# EasyEDA Pro project Armor_ProProject.epro, board PCB12
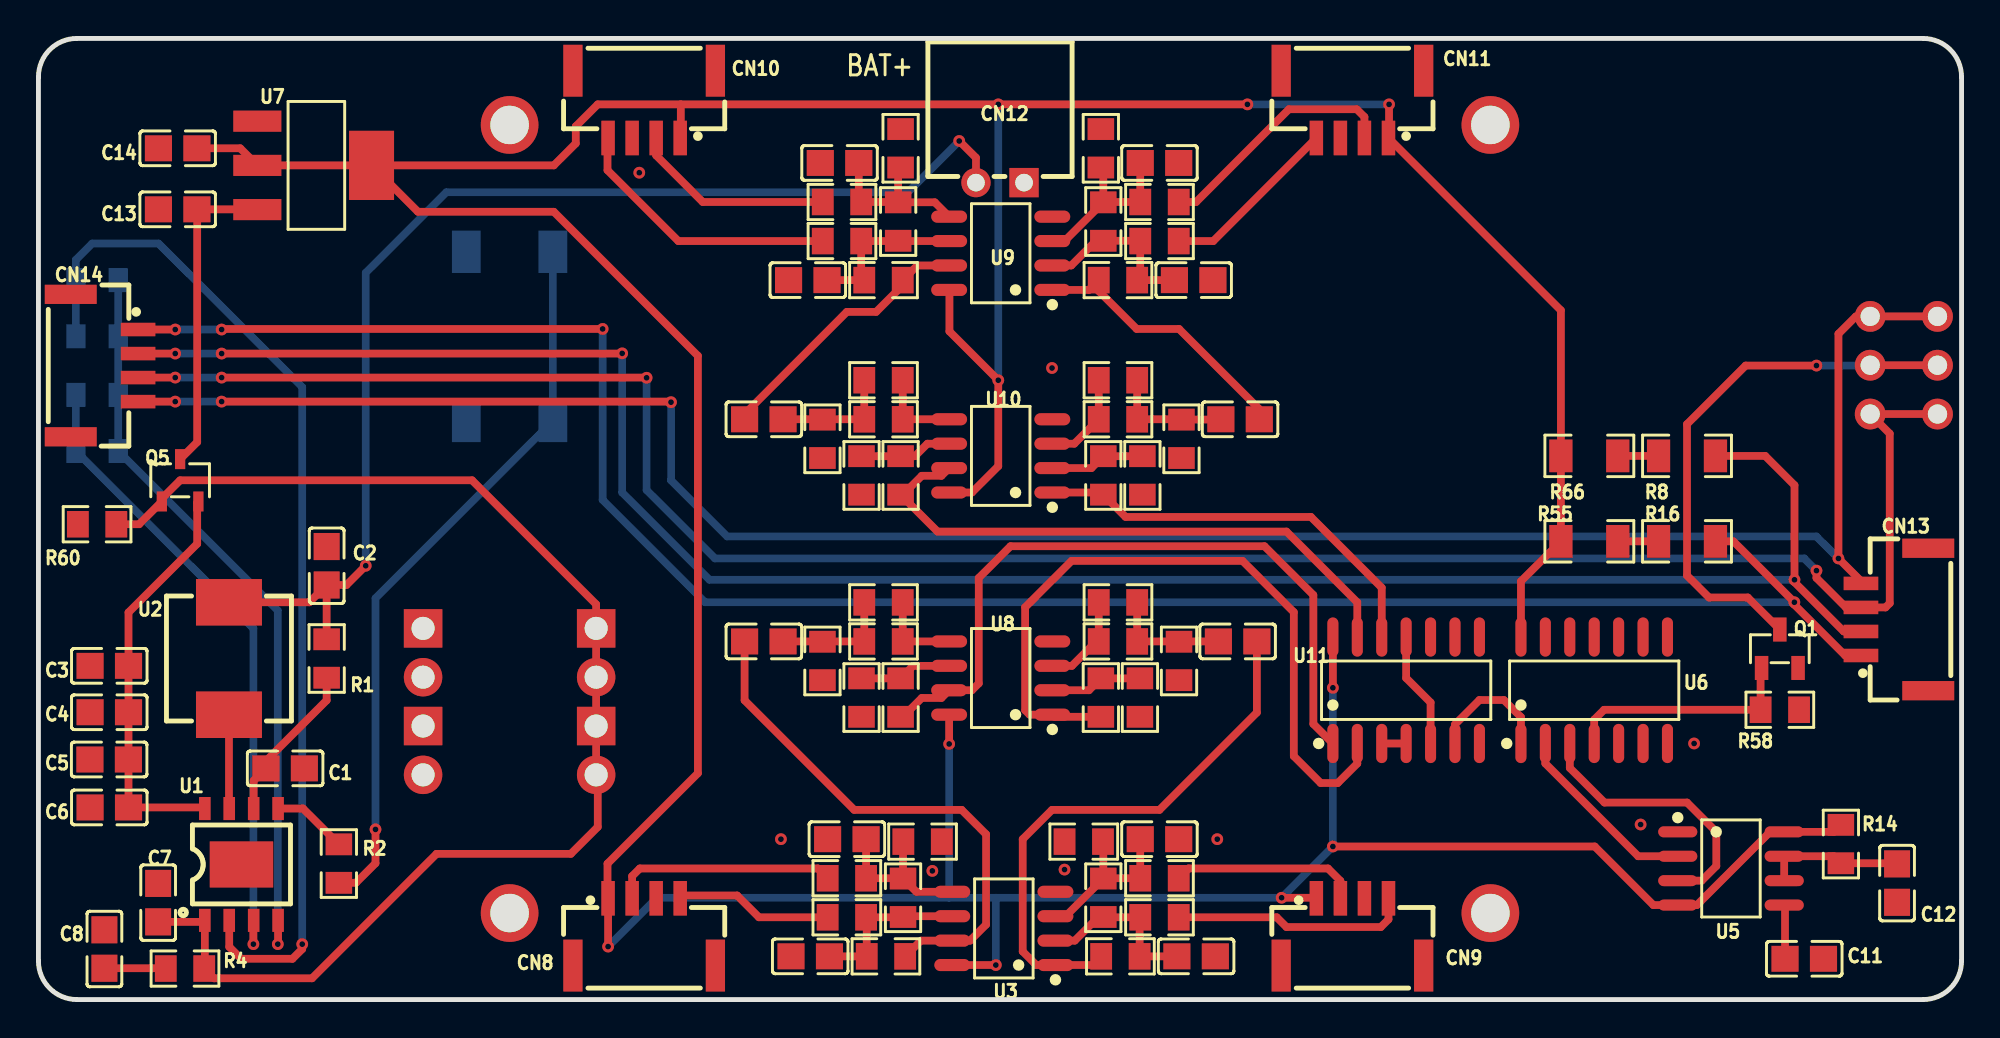
[diagram p12: board, top side]
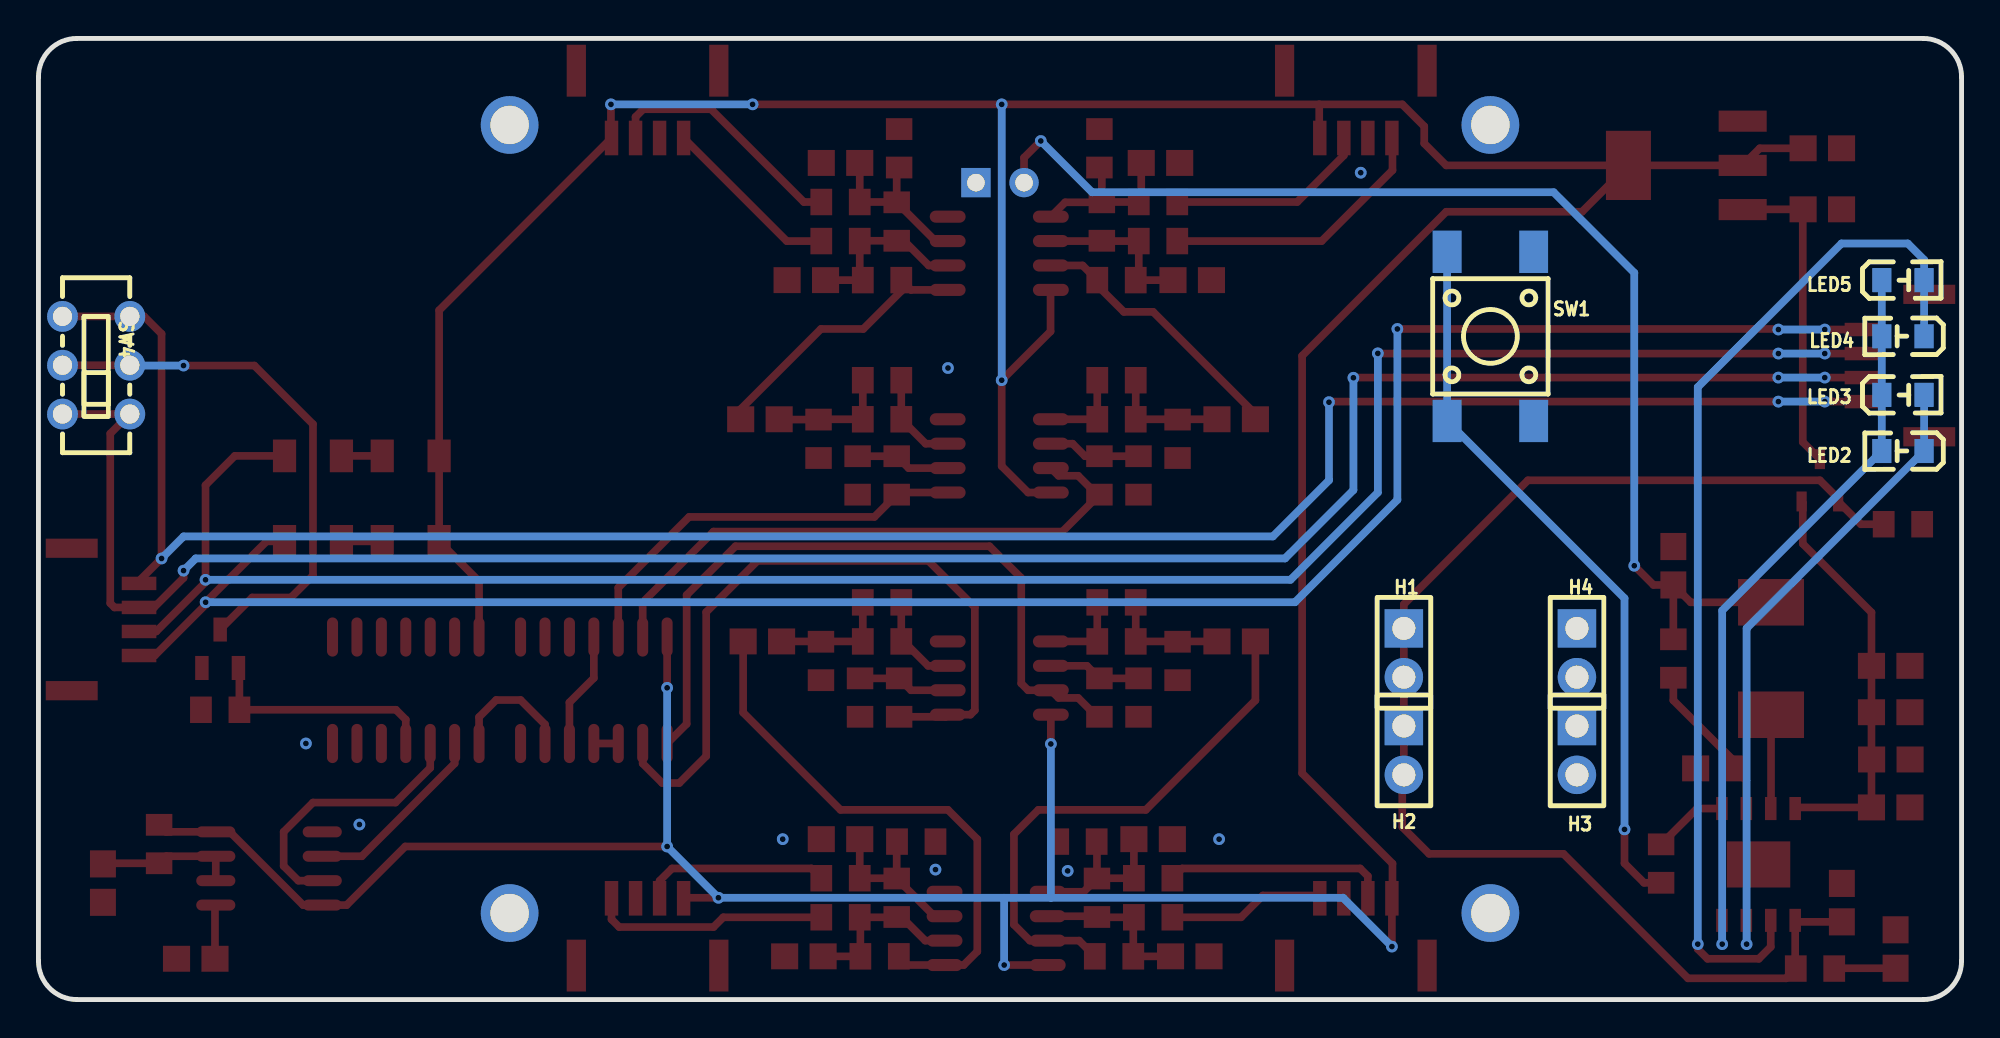
[diagram p13: board, bottom side, seen from below]

Outline 100 x 50 mm; copper layers: Top Layer, Bottom Layer. Coordinates in mm from the lower left corner of the outline.
Outline path: 0,48 0,2 arc(0.59,0.59) 2,0 98,0 arc(99.41,0.59) 100,2 100,48 arc(99.41,49.41) 98,50 2,50 arc(0.59,49.41) 0,48
Stack: Top Layer 0.035mm / Dielectric1 1.51mm FR4 er 4.5 / Bottom Layer 0.035mm

## Design rules (mm)
template: JLCPCB Capability(Two Layers Board)
spacing copperThickness1oz (default): track to track 0.102, other pairs 0.152 to 0.3
spacing copperThickness2oz: track to track 0.203, other pairs 0.152 to 0.3
track width copperThickness1oz (default): min 0.127, default 0.254, max 2.54
track width copperThickness2oz: min 0.203, default 0.254, max 2.54
differential pair differentialPair (default): width min 0.127, default 0.254, max 2.54; gap min 0.152, default 0.152
via viaSize (default): diameter min 0.5, default 0.61, max 10; hole min 0.3, default 0.305, max 6.3

## Placement (name value [footprint] x y rotation side)
C1  22uF  [C0805]  12.83 12.03 180 top
C2  22uF  [C0805]  14.99 22.57 270 top
C3  22uF  [C0805]  3.68 17.36 0 top
C4  22uF  [C0805]  3.68 14.95 0 top
C5  22uF  [C0805]  3.68 12.49 0 top
C6  22uF  [C0805]  3.68 10 0 top
C7  10uF  [C0805]  6.22 5.04 90 top
C8  10uF  [C0805]  3.43 2.63 90 top
C9  100nF  [C0805]  42.04 8.34 0 top
C10  100nF  [C0805]  40.13 2.25 180 top
C11  10nF  [C0805]  91.82 2.12 180 top
C12  10uF  [C0805]  96.65 6.06 90 top
C13  10uF  [C0805]  7.24 41.11 0 top
C14  10uF  [C0805]  7.24 44.28 180 top
C15  100nF  [C0805]  58.29 8.34 180 top
C16  100nF  [C0805]  60.2 2.25 0 top
C17  100nF  [C0805]  62.36 18.63 180 top
C18  100nF  [C0805]  37.72 18.63 0 top
C19  100nF  [C0805]  40 37.43 180 top
C20  100nF  [C0805]  41.66 43.52 0 top
C21  100nF  [C0805]  58.29 43.52 180 top
C22  100nF  [C0805]  60.07 37.43 0 top
C23  100nF  [C0805]  62.48 30.19 180 top
C24  100nF  [C0805]  37.72 30.19 0 top
CN8  应变片1  [CONN-SMD_4P-P1.27_GH125-S04DCA-00]  31.5 3.52 0 top
CN9  应变片2  [CONN-SMD_4P-P1.27_GH125-S04DCA-00]  68.33 3.52 0 top
CN10  应变片3  [CONN-SMD_4P-P1.27_GH125-S04DCA-00]  31.5 46.57 180 top
CN11  应变片4  [CONN-SMD_4P-P1.27_GH125-S04DCA-00]  68.33 46.57 180 top
CN12  电池  [CONN-TH_2P-P2.50_HDGC2501WR-2P]  50 42.5 180 top
CN13  LED2  [CONN-SMD_4P-P1.27_GH125-S04DCA-00]  96.52 19.77 90 top
CN14  LED1  [CONN-SMD_4P-P1.27_GH125-S04DCA-00]  3.43 32.98 270 top
H1  -  [HDR-TH_2P-P2.54-V-F]  29 18.04 270 bottom
H2  -  [HDR-TH_2P-P2.54-V-F]  29 12.96 270 bottom
H3  -  [HDR-TH_2P-P2.54-V-F]  20 12.96 270 bottom
H4  -  [HDR-TH_2P-P2.54-V-F]  20 18.04 270 bottom
LED2  D4  [LED0805-RD]  3.05 28.54 0 bottom
LED3  D3  [LED0805-RD]  3.05 31.46 180 bottom
LED4  D2  [LED0805-RD]  3.05 34.51 0 bottom
LED5  D1  [LED0805-RD]  3.05 37.43 180 bottom
NOREF  -  [Pad_e256]  24.5 45.5 0 top
NOREF#2  -  [Pad_e259]  75.5 45.5 0 top
NOREF#3  -  [Pad_e257]  24.5 4.5 0 top
NOREF#4  -  [Pad_e258]  75.5 4.5 0 top
Q1  NMOS  [SOT-23-3_L2.9-W1.3-P1.90-LS2.4-BR]  90.55 18.25 270 top
Q5  PMOS  [SOT-23-3_L3.0-W1.7-P0.95-LS2.9-BR]  7.37 27.01 270 top
R1  500mΩ  [R0805]  14.99 17.74 90 top
R2  10kΩ  [R0805]  15.62 7.07 90 top
R4  2Ω  [R0805]  7.62 1.61 180 top
R6  100Ω  [R0805]  42.04 6.31 180 top
R7  100Ω  [R0805]  42.04 4.28 0 top
R8  2Ω  [R1206]  85.72 28.28 0 top
R13  10kΩ  [R0805]  44.96 5.3 270 top
R14  5.1kΩ  [R0805]  93.73 8.09 270 top
R16  150mΩ  [R1206]  85.72 23.84 0 top
R17  33kΩ  [R0805]  44.07 2.25 0 top
R18  33kΩ  [R0805]  45.97 8.22 0 top
R19  10kΩ  [R0805]  55.37 5.3 270 top
R20  33kΩ  [R0805]  54.36 8.22 180 top
R21  33kΩ  [R0805]  56.26 2.25 180 top
R22  100Ω  [R0805]  58.29 4.28 180 top
R23  100Ω  [R0805]  58.29 6.31 180 top
R24  1kΩ  [R0805]  59.31 17.61 270 top
R25  1kΩ  [R0805]  40.77 17.61 270 top
R26  100Ω  [R0805]  56.13 18.63 180 top
R27  33kΩ  [R0805]  56.13 20.66 180 top
R28  100Ω  [R0805]  43.94 18.63 0 top
R29  33kΩ  [R0805]  43.94 20.66 0 top
R30  100Ω  [R0805]  57.28 15.71 90 top
R31  100Ω  [R0805]  42.8 15.71 90 top
R32  33kΩ  [R0805]  55.25 15.71 270 top
R33  33kΩ  [R0805]  44.83 15.71 270 top
R34  100Ω  [R0805]  41.78 41.49 180 top
R35  100Ω  [R0805]  41.78 39.46 0 top
R36  10kΩ  [R0805]  44.7 40.47 270 top
R37  33kΩ  [R0805]  44.83 44.28 90 top
R38  33kΩ  [R0805]  43.94 37.43 0 top
R39  10kΩ  [R0805]  55.37 40.47 270 top
R40  33kΩ  [R0805]  55.25 44.28 90 top
R41  33kΩ  [R0805]  56.13 37.43 180 top
R42  100Ω  [R0805]  58.29 39.46 180 top
R43  100Ω  [R0805]  58.29 41.49 180 top
R44  1kΩ  [R0805]  59.44 29.17 270 top
R45  1kΩ  [R0805]  40.77 29.17 270 top
R46  100Ω  [R0805]  56.13 30.19 180 top
R47  33kΩ  [R0805]  56.13 32.22 180 top
R48  100Ω  [R0805]  43.94 30.19 0 top
R49  33kΩ  [R0805]  43.94 32.22 0 top
R50  100Ω  [R0805]  57.4 27.27 90 top
R51  100Ω  [R0805]  42.8 27.27 90 top
R52  33kΩ  [R0805]  55.37 27.27 270 top
R53  33kΩ  [R0805]  44.83 27.27 270 top
R55  1.5Ω  [R1206]  80.65 23.84 0 top
R58  10kΩ  [R0805]  90.55 15.08 180 top
R60  10kΩ  [R0805]  3.05 24.73 180 top
R66  1Ω  [R1206]  80.65 28.28 0 top
SW1  KH-6X6X4.3H-STM  [SW-SMD_4P-L6.0-W6.0-P4.50-LS9.0]  24.5 34.5 270 bottom
SW4  R/B SW  [SW-TH_MSS22D18GX]  97 33 270 bottom
U1  充电宝  [ESOP-8_L4.9-W3.9-P1.27-LS6.0-BL-EP]  10.56 7.03 0 top
U2  1uH  [IND-SMD_L6.5-W6.5_IHLP-2525]  9.91 17.74 90 top
U3  LM358  [SOP-8_L4.9-W3.9-P1.27-LS6.0-BL]  50.2 3.7 90 top
U5  小于Vcc/3触发 输出高电平  [SOP-8_L5.0-W4.0-P1.27-LS6.0-BL]  88.01 6.82 270 top
U6  非门  [SOIC-14_L8.7-W3.9-P1.27-LS6.0-BL]  80.9 16.09 0 top
U7  NCP1117ST33T3G  [SOT-223-3_L6.5-W3.4-P2.30-LS7.0-BR]  14.35 43.4 180 top
U8  LM358  [SOP-8_L4.9-W3.9-P1.27-LS6.0-BL]  50.04 16.73 90 top
U9  LM358  [SOP-8_L4.9-W3.9-P1.27-LS6.0-BL]  50.04 38.82 90 top
U10  LM358  [SOP-8_L4.9-W3.9-P1.27-LS6.0-BL]  50.04 28.28 90 top
U11  或门  [SOIC-14_L8.7-W3.9-P1.27-LS6.0-BL]  71.12 16.09 0 top

## Footprints (pads in the part's own frame, mm; a bottom-side part is the same pattern mirrored in y, then rotated)
C0805
  rect 1.41x1.35 smd: 1(-1,0) 2(1,0)
CONN-SMD_4P-P1.27_GH125-S04DCA-00
  rect 0.7x1.8 smd: 1(-1.875,1.75) 2(-0.625,1.75) 3(0.625,1.75) 4(1.875,1.75)
  rect 1x2.7 smd: 5(3.705,-1.75) 6(-3.705,-1.75)
CONN-TH_2P-P2.50_HDGC2501WR-2P
  rect 1.524x1.524 hole 0.914: 1(-1.25,0)
  round 1.524 hole 0.914: 2(1.25,0)
ESOP-8_L4.9-W3.9-P1.27-LS6.0-BL-EP
  rect 0.6x1.2 smd: 1(-1.905,-2.909) 2(-0.635,-2.909) 3(0.635,-2.909) 4(1.905,-2.909) 5(1.905,2.909) 6(0.635,2.909) 7(-0.635,2.909) 8(-1.905,2.909)
  rect 3.3x2.4 smd: 9(0,0)
HDR-TH_2P-P2.54-V-F
  rect 2x2 hole 1.2: 1(-1.27,0)
  round 2 hole 1.2: 2(1.27,0)
IND-SMD_L6.5-W6.5_IHLP-2525
  rect 2.42x3.43 smd: 1(-2.925,0) 2(2.925,0)
LED0805-RD
  rect 1x1.25 smd: 1(-1.1,0) 2(1.1,0)
Pad_e256
  round 3 hole 2: 1(0,0)
Pad_e257
  round 3 hole 2: 1(0,0)
Pad_e258
  round 3 hole 2: 1(0,0)
Pad_e259
  round 3 hole 2: 1(0,0)
R0805
  rect 1.133x1.377 smd: 1(-1,0) 2(1,0)
R1206
  rect 1.208x1.701 smd: 1(-1.479,0) 2(1.479,0)
SOIC-14_L8.7-W3.9-P1.27-LS6.0-BL
  oval 0.574x2.038 smd: 1(-3.81,-2.769) 2(-2.54,-2.769) 3(-1.27,-2.769) 4(0,-2.769) 5(1.27,-2.769) 6(2.54,-2.769) 7(3.81,-2.769) 8(3.81,2.769) 9(2.54,2.769) 10(1.27,2.769) 11(0,2.769) 12(-1.27,2.769) 13(-2.54,2.769) 14(-3.81,2.769)
SOP-8_L4.9-W3.9-P1.27-LS6.0-BL
  oval 0.63x1.865 smd: 1(-1.905,-2.683) 2(-0.635,-2.683) 3(0.635,-2.683) 4(1.905,-2.683) 5(1.905,2.683) 6(0.635,2.683) 7(-0.635,2.683) 8(-1.905,2.683)
SOP-8_L5.0-W4.0-P1.27-LS6.0-BL
  oval 0.574x2.035 smd: 1(-1.905,-2.768) 2(-0.635,-2.768) 3(0.635,-2.768) 4(1.905,-2.768) 5(1.905,2.768) 6(0.635,2.768) 7(-0.635,2.768) 8(-1.905,2.768)
SOT-23-3_L2.9-W1.3-P1.90-LS2.4-BR
  rect 1.25x0.7 smd: 1(1,-0.95) 2(1,0.95) 3(-1,0)
SOT-23-3_L3.0-W1.7-P0.95-LS2.9-BR
  rect 1.038x0.532 smd: 1(1.101,-0.95) 2(1.101,0.95) 3(-1.101,0)
SOT-223-3_L6.5-W3.4-P2.30-LS7.0-BR
  rect 2.5x1.1 smd: 1(2.97,-2.3) 2(2.97,0) 3(2.97,2.3)
  rect 2.34x3.6 smd: 4(-2.97,0)
SW-SMD_4P-L6.0-W6.0-P4.50-LS9.0
  rect 2.2x1.5 smd: 1(-4.4,2.25) 2(-4.4,-2.25) 3(4.4,2.25) 4(4.4,-2.25)
SW-TH_MSS22D18GX
  round 1.6 hole 1: 1(-2.54,1.75) 2(0,1.75) 3(2.54,1.75) 4(-2.54,-1.75) 5(0,-1.75) 6(2.54,-1.75)

## Nets
As in the schematic.

Pads without a net: CN8 5 6; CN9 5 6; CN10 5 6; CN11 5 6; CN13 5 6; CN14 5 6; NOREF 1; NOREF#2 1; NOREF#3 1; NOREF#4 1; U6 5 6 8 9 10 11 12 13; U11 8 9 10

## Via types
v1: diameter 0.61, hole 0.305, Top Layer to Bottom Layer, 41 vias

## Routing (per net, layer and track width the routed paths; a pad name or vN(x,y) marks a point on that pad's centre or on a via; arc(x,y) is an arc through that point)
3V3: length 277
  Top Layer w0.4: U7.4 19.73,40.98 26.8,40.98 34.29,33.49 34.29,11.77 29.59,7.07 29.59,5.3 CN8.1 v1(29.62,2.76) ; U7.4 U7.2 10.49,44.28 C14.1 ; U7.4 26.8,43.4 27.94,44.54 27.94,45.43 29.08,46.57 33.4,46.57 ; CN9.1 66.42,5.3 v1(64.64,5.3) ; 33.4,46.57 33.4,44.85 CN10.1 ; 33.4,46.57 v1(49.91,46.57) v1(62.87,46.57) ; U8.8 v1(47.36,13.3) ; U3.8 v1(49.78,1.8) ; U10.8 48.54,26.38 49.91,27.75 v1(49.91,32.22) 47.37,34.76 47.37,36.9 U9.8 ; U6.14 77.09,21.76 R55.1 R66.1 79.17,35.86 CN11.1 70.23,44.85 v1(70.23,46.57) ; v1(67.31,7.96) 80.93,7.96 83.97,4.92 86.24,4.92 90.05,8.72 U5.8 93.36,8.72 R14.1 ; U11.14 v1(67.31,16.22)
  Bottom Layer w0.4: v1(62.87,46.57) v1(70.23,46.57) ; v1(49.91,46.57) v1(49.91,32.22) ; 47.35,5.3 32.16,5.3 v1(29.62,2.76) ; 47.35,5.3 49.79,5.3 ; 47.35,5.3 47.36,5.3 v1(47.36,13.3) ; v1(49.78,1.8) 49.78,5.29 49.79,5.3 ; v1(67.31,16.22) v1(67.31,7.96) v1(64.64,5.3) 49.79,5.3
GND:
  vias: v1(31.24,43.02) v1(38.61,8.34) v1(46.48,6.69) v1(52.71,32.86) v1(53.36,6.76) v1(61.3,8.34) v1(83.31,9.11) v1(86.09,13.32)
1GRAY: length 8.2
  Top Layer w0.4: CN8.4 33.52,5.41 36.33,5.41 37.47,4.28 R7.1
1WHITE: length 11.9
  Top Layer w0.4: R6.2 40.53,6.82 31.27,6.82 30.87,6.42 30.87,5.01
555OUT: length 14.4
  Top Layer w0.4: U5.3 86.49,6.19 87.25,6.95 87.25,8.72 85.72,10.25 81.43,10.25 79.63,12.05 U6.3
555OUTNO: length 12.3
  Top Layer w0.4: Q1.1 89.55,17.2 R58.2 81.41,15.08 80.9,14.56 U6.4
B-: length 113.5
  Top Layer w0.4: v1(92.46,22.31) 92.46,21.93 93.99,20.4 96.05,20.4 96.27,20.62 96.27,29.44 SW4.3 SW4.6 ; CN14.3 v1(7.11,32.36) ; v1(9.53,32.36) 31.61,32.36 v1(31.62,32.35)
  Bottom Layer w0.4: v1(92.46,22.31) 91.82,22.95 35.18,22.95 31.62,26.5 v1(31.62,32.35) ; v1(7.11,32.36) v1(9.53,32.36)
BAT+: length 62.2
  Top Layer w0.4: v1(17.02,22.57) 16.02,21.57 C2.2 ; CN12.2 48.75,43.8 v1(47.88,44.67) ; C2.2 14.08,20.67 U2.2 ; C2.2 R1.2
  Bottom Layer w0.4: v1(47.88,44.67) 45.21,42 21.21,42 17.02,37.81 v1(17.02,22.57)
NMOS-D: length 28.2
  Top Layer w0.4: SW4.2 SW4.5 ; v1(92.46,32.98) 88.77,32.98 85.72,29.93 85.72,22.06 86.87,20.92 88.88,20.92 Q1.3
  Bottom Layer w0.4: SW4.2 95.23,32.98 v1(92.46,32.98)
POWERBANK5VOUT: length 21.4
  Top Layer w0.4: U1.8 8.59,10 C6.2 4.68,12.48 C5.2 4.68,12.5 C4.2 C3.2 4.68,20.14 8.25,23.71 8.25,25.85 Q5.2
R-: length 113.2
  Top Layer w0.4: v1(32.89,31.08) 32.86,31.11 v1(9.53,31.11) ; CN14.4 v1(7.11,31.11) ; 94.9,21.65 v1(93.6,22.95) 93.6,34.63 94.51,35.54 SW4.1 SW4.4
  Bottom Layer w0.4: v1(32.89,31.08) 32.89,27.01 35.81,24.09 92.45,24.09 v1(93.6,22.95) ; v1(7.11,31.11) v1(9.53,31.11)
SGPO1: length 37.5
  Top Layer w0.4: R33.2 44.95,14.71 45.93,15.69 46.96,15.69 U8.7 48.54,16.09 48.9,16.45 48.9,21.93 50.55,23.58 63.75,23.58 66.29,21.04 66.29,14.34 U11.1
SGPO2: length 38.3
  Top Layer w0.4: R32.2 52.83,14.71 U8.1 51.54,14.82 51.31,15.05 51.31,20.41 53.72,22.82 62.61,22.82 65.28,20.16 65.28,12.66 66.68,11.27 67.56,11.27 68.58,12.28 U11.2
SGPO3: length 31
  Top Layer w0.4: U10.7 46.96,27.25 45.93,27.25 44.95,26.27 R53.2 46.75,24.35 64.9,24.35 68.58,20.66 U11.13
SGPO4: length 21.7
  Top Layer w0.4: U10.1 55.26,26.38 R52.2 56.53,25.11 66.17,25.11 69.85,21.42 U11.12
SGPO-NO: length 9.9
  Top Layer w0.4: U5.2 83.19,7.45 78.36,12.28 U6.2
SGPO-OR: length 6.7
  Top Layer w0.4: U6.1 77.09,14.69 76.2,15.58 74.93,15.58 73.66,14.31 U11.6
TYPEC-IN: length 69.2
  Top Layer w0.4: R60.1 5.23,24.73 Q5.1 6.42,26.06 7.37,27.01 22.55,27.01 29,20.56 H1.1 H1.2 H2.1 H2.2 29.08,11.61 29.08,8.98 27.69,7.58 20.7,7.58 14.22,1.1 9.13,1.1 R4.1 8.65,1.64 U1.1 8.57,4.04 C7.1
$1N1798: length 8.5
  Top Layer w0.4: U3.6 45,4.34 44.94,4.28 R7.2 43.07,4.25 R17.1 C10.1
$1N1799: length 28.1
  Top Layer w0.4: R17.2 45.89,3.07 U3.7 48.44,3.07 49.28,3.9 49.28,8.6 48.01,9.87 42.42,9.87 36.72,15.57 C18.1
$1N1800: length 8.7
  Top Layer w0.4: R13.1 45.65,5.61 U3.5 ; R13.1 44.96,8.2 R18.1 ; R13.1 44.94,6.31 R6.1 C9.2
$1N3086: length 9.2
  Top Layer w0.4: R19.1 55.39,6.31 R23.2 C15.2 ; R19.1 55.37,8.2 R20.1 ; R19.1 53.41,4.34 U3.3
$1N3192: length 8.9
  Top Layer w0.4: C16.1 R21.1 57.26,4.25 R22.2 55.39,4.28 R19.2 55.12,4.3 53.89,3.07 U3.2
$1N9316: length 10
  Top Layer w0.4: R23.1 59.8,6.82 67.06,6.82 67.7,6.17 67.7,5.01
$1N9324: length 12.1
  Top Layer w0.4: 70.2,5.01 70.2,4.17 69.8,3.77 64.9,3.77 64.39,4.28 R22.1
$1N9328: length 29
  Top Layer w0.4: R21.2 54.81,1.8 U3.1 51.89,1.8 51.18,2.5 51.18,8.34 52.71,9.87 58.29,9.87 63.36,14.93 C17.1
$1N10758: length 6.3
  Top Layer w0.4: C18.2 40.75,18.63 R25.1 40.78,18.63 R28.1 R29.1
$1N10764: length 6.3
  Top Layer w0.4: R27.1 R26.1 59.29,18.63 ; C17.2 59.29,18.63 ; 59.29,18.63 R24.1
$1N10767: length 5
  Top Layer w0.4: U8.3 53.74,17.36 55.01,18.63 R26.2 R27.2
$1N10771: length 4.4
  Top Layer w0.4: R29.2 R28.2 U8.5
$1N10927: length 4.8
  Top Layer w0.4: R30.2 R32.1 54.63,16.09 U8.2
$1N10971: length 4.8
  Top Layer w0.4: R31.2 R33.1 45.48,17.36 U8.6
$1N12384: length 8.6
  Top Layer w0.4: U9.6 44.72,39.46 R36.2 44.69,39.46 R35.2 42.78,37.59 R38.1 C19.1
$1N12385: length 14.3
  Top Layer w0.4: U9.7 45.7,38.19 R38.2 44.94,37.16 43.56,35.78 42.04,35.78 36.72,30.46 C24.1
$1N12386: length 8.8
  Top Layer w0.4: R37.1 44.7,43.16 R36.1 ; R36.1 46.61,41.47 U9.5 ; R36.1 44.69,41.49 R34.1 42.66,41.62 C20.2
$1N12397: length 9.3
  Top Layer w0.4: R40.1 55.37,43.16 R39.1 ; U9.3 53.36,39.46 R39.1 ; R39.1 55.39,41.49 R43.2 C21.2
$1N12398: length 9.1
  Top Layer w0.4: U9.2 53.71,38.19 54.99,39.47 R39.2 57.28,39.47 R42.2 57.29,37.59 R41.1 C22.1
$1N12405: length 10.6
  Top Layer w0.4: R34.2 34.54,41.49 32.12,43.91 CN10.2
$1N12407: length 14.6
  Top Layer w0.4: 29.62,44.89 29.59,44.89 29.59,43.14 33.27,39.46 R35.1 ; 29.62,44.89 CN10.4 ; 29.62,44.89 29.59,44.92
$1N12415: length 12.9
  Top Layer w0.4: R43.1 60.2,41.49 65.02,46.32 68.55,46.32 68.95,45.92 CN11.2
$1N12417: length 9.4
  Top Layer w0.4: R42.1 61.09,39.46 CN11.4
$1N12421: length 14.6
  Top Layer w0.4: U9.1 54.63,36.92 R41.2 55.13,36.86 57.11,34.89 59.31,34.89 63.48,30.71 C23.1
$1N12428: length 6.3
  Top Layer w0.4: C24.2 40.75,30.19 R45.1 40.78,30.19 R48.1 R49.1
$1N12432: length 6.4
  Top Layer w0.4: C23.2 61.47,30.17 R44.1 59.42,30.19 R46.1 R47.1
$1N12436: length 5
  Top Layer w0.4: R47.2 R46.2 53.86,28.92 U10.3
$1N12438: length 4.4
  Top Layer w0.4: R49.2 R48.2 U10.5
$1N12448: length 4.9
  Top Layer w0.4: R50.2 R52.1 54.75,27.65 U10.2
$1N12454: length 4.8
  Top Layer w0.4: U10.6 46.23,28.92 45.58,28.27 R53.1 R51.2
$1N15213: length 1.3
  Top Layer w0.4: U11.3 U11.4
$1N15218: length 6.1
  Top Layer w0.4: U11.11 71.12,16.73 72.39,15.46 U11.5
$1N15499: length 2.8
  Top Layer w0.4: 90.78,4.92 90.82,4.87 C11.2
$1N15503: length 7.3
  Top Layer w0.4: U5.6 U5.7 93.36,7.45 R14.2 96.62,7.09 C12.2
$1N98312: length 4.9
  Top Layer w0.4: U2.1 9.91,9.95 U1.7
$1N98313: length 8.4
  Top Layer w0.4: U1.6 11.19,11.39 C1.2 11.83,12.41 14.99,15.57 R1.1
$1N98315: length 39.2
  Top Layer w0.4: U1.4 12.46,2.9 v1(12.45,2.88)
  Bottom Layer w0.4: LED5.1 LED4.2 LED3.1 LED2.2 12.45,20.24 v1(12.45,2.88)
$1N98316: length 33.6
  Top Layer w0.4: U1.3 11.18,4.11 v1(11.18,2.88)
  Bottom Layer w0.4: LED3.2 LED2.1 11.18,19.31 v1(11.18,2.88)
$1N98317: length 54.1
  Top Layer w0.4: U1.2 9.92,2.74 10.54,2.12 13.21,2.12 13.72,2.63 v1(13.72,2.88)
  Bottom Layer w0.4: v1(13.72,2.88) 13.72,31.86 6.24,39.33 2.79,39.33 1.95,38.49 LED5.2 LED4.1
$1N98319: length 3.2
  Top Layer w0.4: 3.43,1.63 6.6,1.63 R4.2
$1N98321: length 38
  Top Layer w0.4: R2.1 16.51,6.07 17.53,7.09 v1(17.53,8.85)
  Bottom Layer w0.4: SW1.2 SW1.4 17.53,20.88 v1(17.53,8.85)
$1N98333: length 16.5
  Top Layer w0.4: Q5.3 8.25,29 8.25,41.09 C13.2 11.37,41.11 U7.3
$1N98338: length 3.9
  Top Layer w0.4: U1.5 13.76,9.94 R2.2
$1N98741: length 2.1
  Top Layer w0.4: R66.2 R8.1
$1N98742: length 2.1
  Top Layer w0.4: R16.1 R55.2
$1N98745: length 107.5
  Top Layer w0.4: v1(9.53,34.86) 9.56,34.89 v1(29.34,34.89) ; 94.9,17.9 93.95,17.9 91.31,20.54 v1(91.31,20.67) 88.14,23.84 R16.2 ; CN14.1 v1(7.11,34.86)
  Bottom Layer w0.4: v1(7.11,34.86) v1(9.53,34.86) ; v1(29.34,34.89) 29.34,26 34.66,20.67 v1(91.31,20.67)
$1N98746: length 109.7
  Top Layer w0.4: CN14.2 v1(7.11,33.61) ; 94.9,19.15 93.87,19.15 91.31,21.71 v1(91.31,21.84) 91.31,26.76 89.79,28.28 R8.2 ; v1(9.53,33.61) 30.34,33.61 v1(30.35,33.62)
  Bottom Layer w0.4: v1(30.35,33.62) 30.35,26.38 34.89,21.84 v1(91.31,21.84) ; v1(7.11,33.61) v1(9.53,33.61)

## Copper pours and planes (outline as drawn; the poured copper is in the pictures)
3V3 on Top Layer: 12.95,48.98 22.57,48.98 22.57,38.98 12.95,38.98
GND on Top Layer: -13.33,63.84 101.35,63.84 101.35,-1.56 -13.33,-1.56
GND on Bottom Layer: -0.89,51.52 112.27,51.52 112.27,-12.36 -0.89,-12.36

## Text on the board
Top Silkscreen Layer: BAT+
